# EAGLE design breakout4hold (EAGLE 7.2.0)
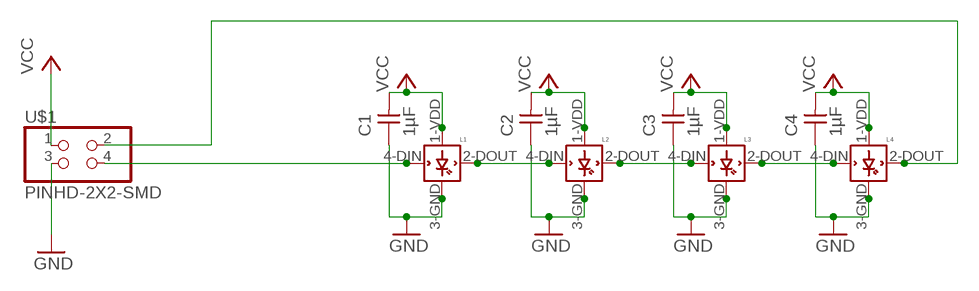
[diagram p0: schematic, sheet 1]

## Parts
C1  1µF  CAP-UNPOLARIZEDFAB  [C1206FAB]
C2  1µF  CAP-UNPOLARIZEDFAB  [C1206FAB]
C3  1µF  CAP-UNPOLARIZEDFAB  [C1206FAB]
C4  1µF  CAP-UNPOLARIZEDFAB  [C1206FAB]
L1  WS2812B  [WS2812B]
L2  WS2812B  [WS2812B]
L3  WS2812B  [WS2812B]
L4  WS2812B  [WS2812B]
U$1  PINHD-2X2-SMD  [2X02SMD]

## Nets
GND: C1.1 C2.1 C3.1 C4.1 L1.3-GND(GND) L2.3-GND(GND) L3.3-GND(GND) L4.3-GND(GND) U$1.3
N$1: L4.2-DOUT(DOUT) U$1.2
N$4: L1.4-DIN(DIN) U$1.4
N$12: L1.2-DOUT(DOUT) L2.4-DIN(DIN)
N$13: L2.2-DOUT(DOUT) L3.4-DIN(DIN)
N$14: L3.2-DOUT(DOUT) L4.4-DIN(DIN)
VCC: C1.2 C2.2 C3.2 C4.2 L1.1-VDD(VDD) L2.1-VDD(VDD) L3.1-VDD(VDD) L4.1-VDD(VDD) U$1.1

## Library data of the parts
C1-C4 = fab:CAP-UNPOLARIZED
L1-L4 = adafruit:WS2812B
U$1 = fab:PINHD-2X2-SMD

## Board
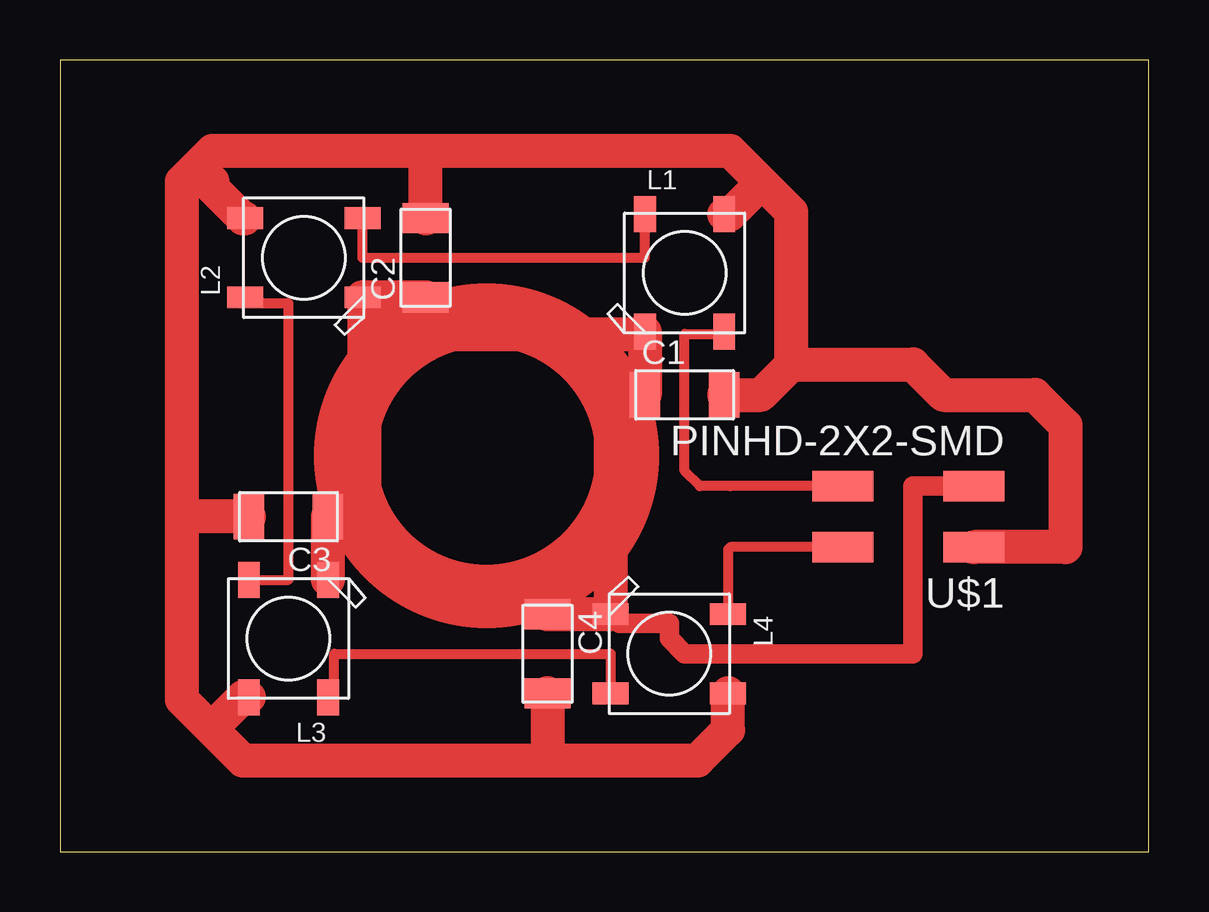
[diagram p1: board, top side]

Size 45.39 x 33.01 mm. Coordinates in mm from the lower left corner, seen from the top.
Outline: 0,0 45.39,0 45.39,33.01 0,33.01 0,0
Copper layers (1*16): Top 0.035mm / dielectric 1.5mm / Bottom 0.035mm
Design rules "default": minimum track width 10mil, minimum drill 24mil, track to track 8mil, track to pad 8mil, pad to pad 8mil, via to via 8mil, smd to smd 8mil, copper to edge 40mil, drill to drill 8mil, minimum pad ring 10mil, minimum via ring 8mil, stop-mask expansion 4mil, vias tented up to drill 0mil, thermal gap 10mil

### Footprints (pad centres in the part's own frame; a part is rotated, then mirrored left to right if it is on the bottom)
C1206FAB = smd 1.27 x 1.905: 1 -1.651,0; 2 1.651,0
WS2812B = smd 1.5 x 0.9: 1-VDD 2.45,-1.65; 2-DOUT 2.45,1.65; 3-GND -2.45,1.65; 4-DIN -2.45,-1.65
2X02SMD = smd 2.54 x 1.27: 1 -2.54,1.27; 2 2.92,1.27; 3 -2.54,-1.27; 4 2.92,-1.27

### Placement (x,y rotation side)
C1  26.04,19.05 0 top
C2  15.24,24.76 90 top
C3  9.52,13.97 180 top
C4  20.32,8.25 270 top
L1  26.04,24.13 90 top
L2  10.16,24.76 180 top
L3  9.52,8.89 270 top
L4  25.4,8.25 0 top
U$1  35.56,13.97 180 top

### Tracks (layer width: path | path; a pad name or v marks a point on that pad's centre or on a via)
GND
  Top 0.813: U$1.3 35.56,15.24 35.56,8.25 26.04,8.25 25.4,8.89 25.4,9.52 23.33,9.52 L4.3-GND
  Top 1.422: C1.1 L1.3-GND 24.38,21.59 15.24,21.59 C2.1 | C1.1 22.95,19.05 L4.3-GND C4.1 | L3.3-GND C3.1 12.7,13.97 12.7,22.86 15.24,22.86 C2.1 | L2.3-GND C2.1 | C1.1 22.86,19.05
N$1
  Top 0.406: U$1.2 27.94,12.7 27.85,12.61 L4.2-DOUT
N$4
  Top 0.406: 27.94,15.24 U$1.4 26.67,15.24 26.04,15.87 26.04,21.59 27.59,21.59 L1.4-DIN
N$12
  Top 0.406: L2.4-DIN 12.61,24.76 24.38,24.76 L1.2-DOUT
N$13
  Top 0.406: L3.4-DIN 9.52,11.34 9.52,22.86 7.71,22.86 L2.2-DOUT
N$14
  Top 0.406: L3.2-DOUT 11.43,6.44 11.43,8.25 22.95,8.25 L4.4-DIN
VCC
  Top 0.406: L4.1-VDD 27.94,6.61
  Top 1.422: C1.2 29.21,19.05 30.48,20.32 | 30.48,20.32 30.48,26.67 29.21,27.94 | 29.21,27.94 27.94,29.21 15.24,29.21 | 15.24,29.21 6.35,29.21 5.72,28.57 | 5.72,28.57 5.08,27.94 5.08,13.97 | 5.08,13.97 5.08,6.35 6.35,5.08 | 6.35,5.08 7.62,3.81 20.32,3.81 | 20.32,3.81 26.58,3.81 27.85,5.08 L4.1-VDD | L3.1-VDD 7.62,6.44 6.35,5.17 6.35,5.08 | L2.1-VDD 7.62,26.42 6.35,27.68 6.35,27.94 5.72,28.57 | L1.1-VDD 27.94,26.58 29.21,27.85 29.21,27.94 | 30.48,20.32 35.56,20.32 36.83,19.05 40.64,19.05 41.91,17.78 41.91,12.7 U$1.1 | C2.2 15.24,29.21 | C3.2 5.08,13.97 | C4.2 20.32,3.81
(copper drawn outside any net)
  shapes: Top circle x3